# Altium schematic sheet M5_Display.SchDoc
size A4
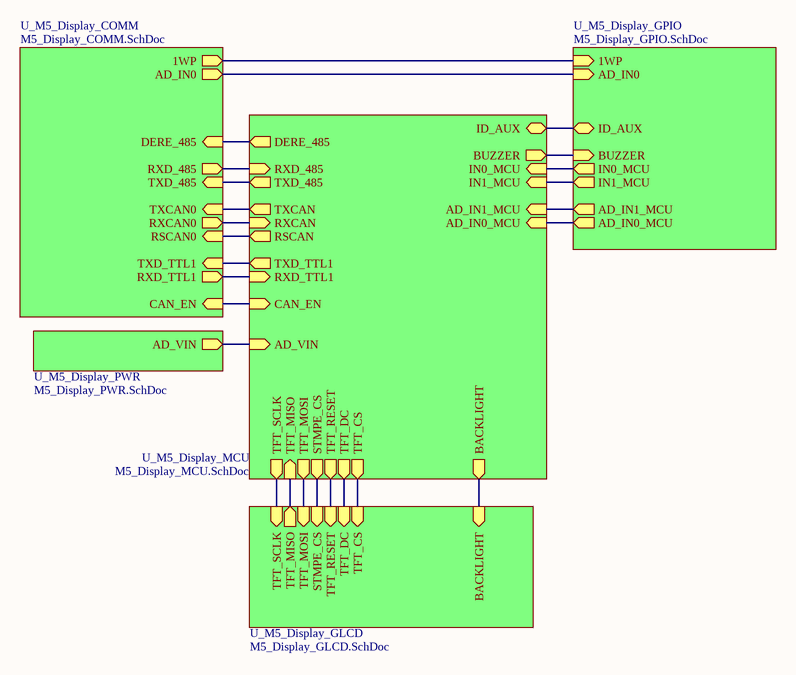
[diagram p0: M5_Display.SchDoc]

## Sub-sheets
U_M5_Display_COMM = M5_Display_COMM.SchDoc: DERE_485 (in), CAN_EN (in), TXD_485 (in), RXD_485 (out), TXD_TTL1 (in), RXD_TTL1 (out), AD_IN0 (out), 1WP (out), RXCAN0 (out), RSCAN0 (in), TXCAN0 (in)
U_M5_Display_GLCD = M5_Display_GLCD.SchDoc: BACKLIGHT (in), TFT_MISO (out), TFT_MOSI (in), STMPE_CS (in), TFT_DC (in), TFT_CS (in), TFT_SCLK (in), TFT_RESET (in)
U_M5_Display_GPIO = M5_Display_GPIO.SchDoc: BUZZER (in), IN0_MCU (out), IN1_MCU (out), AD_IN0_MCU (out), AD_IN0 (in), ID_AUX (bidir), 1WP (in), AD_IN1_MCU (out)
U_M5_Display_MCU = M5_Display_MCU.SchDoc: TXD_485 (out), ID_AUX (bidir), BUZZER (out), BACKLIGHT (out), TXCAN (out), RXCAN (in), RSCAN (out), TXD_TTL1 (out), RXD_TTL1 (in), IN1_MCU (in), IN0_MCU (in), AD_IN0_MCU (in), DERE_485 (out), RXD_485 (in), CAN_EN (in), AD_VIN (in), TFT_SCLK (out), TFT_CS (out), TFT_MOSI (out), TFT_MISO (in), TFT_DC (out), STMPE_CS (out), TFT_RESET (out), AD_IN1_MCU (in)
U_M5_Display_PWR = M5_Display_PWR.SchDoc: AD_VIN (out)

## Nets
(unnamed): sheet U_M5_Display_GLCD/BACKLIGHT, sheet U_M5_Display_MCU/BACKLIGHT
(unnamed): sheet U_M5_Display_GLCD/TFT_MISO, sheet U_M5_Display_MCU/TFT_MISO
(unnamed): sheet U_M5_Display_GLCD/TFT_MOSI, sheet U_M5_Display_MCU/TFT_MOSI
(unnamed): sheet U_M5_Display_GLCD/STMPE_CS, sheet U_M5_Display_MCU/STMPE_CS
(unnamed): sheet U_M5_Display_GLCD/TFT_DC, sheet U_M5_Display_MCU/TFT_DC
(unnamed): sheet U_M5_Display_GLCD/TFT_CS, sheet U_M5_Display_MCU/TFT_CS
(unnamed): sheet U_M5_Display_GLCD/TFT_SCLK, sheet U_M5_Display_MCU/TFT_SCLK
(unnamed): sheet U_M5_Display_GLCD/TFT_RESET, sheet U_M5_Display_MCU/TFT_RESET
(unnamed): sheet U_M5_Display_PWR/AD_VIN, sheet U_M5_Display_MCU/AD_VIN
(unnamed): sheet U_M5_Display_MCU/TXD_485, sheet U_M5_Display_COMM/TXD_485
(unnamed): sheet U_M5_Display_MCU/ID_AUX, sheet U_M5_Display_GPIO/ID_AUX
(unnamed): sheet U_M5_Display_MCU/BUZZER, sheet U_M5_Display_GPIO/BUZZER
(unnamed): sheet U_M5_Display_MCU/TXCAN, sheet U_M5_Display_COMM/TXCAN0
(unnamed): sheet U_M5_Display_MCU/RXCAN, sheet U_M5_Display_COMM/RXCAN0
(unnamed): sheet U_M5_Display_MCU/RSCAN, sheet U_M5_Display_COMM/RSCAN0
(unnamed): sheet U_M5_Display_MCU/TXD_TTL1, sheet U_M5_Display_COMM/TXD_TTL1
(unnamed): sheet U_M5_Display_MCU/RXD_TTL1, sheet U_M5_Display_COMM/RXD_TTL1
(unnamed): sheet U_M5_Display_MCU/IN1_MCU, sheet U_M5_Display_GPIO/IN1_MCU
(unnamed): sheet U_M5_Display_MCU/IN0_MCU, sheet U_M5_Display_GPIO/IN0_MCU
(unnamed): sheet U_M5_Display_MCU/AD_IN0_MCU, sheet U_M5_Display_GPIO/AD_IN0_MCU
(unnamed): sheet U_M5_Display_MCU/DERE_485, sheet U_M5_Display_COMM/DERE_485
(unnamed): sheet U_M5_Display_MCU/RXD_485, sheet U_M5_Display_COMM/RXD_485
(unnamed): sheet U_M5_Display_MCU/CAN_EN, sheet U_M5_Display_COMM/CAN_EN
(unnamed): sheet U_M5_Display_MCU/AD_IN1_MCU, sheet U_M5_Display_GPIO/AD_IN1_MCU
(unnamed): sheet U_M5_Display_COMM/AD_IN0, sheet U_M5_Display_GPIO/AD_IN0
(unnamed): sheet U_M5_Display_COMM/1WP, sheet U_M5_Display_GPIO/1WP